# EAGLE schematic usercontroller (EAGLE 8.5.2)
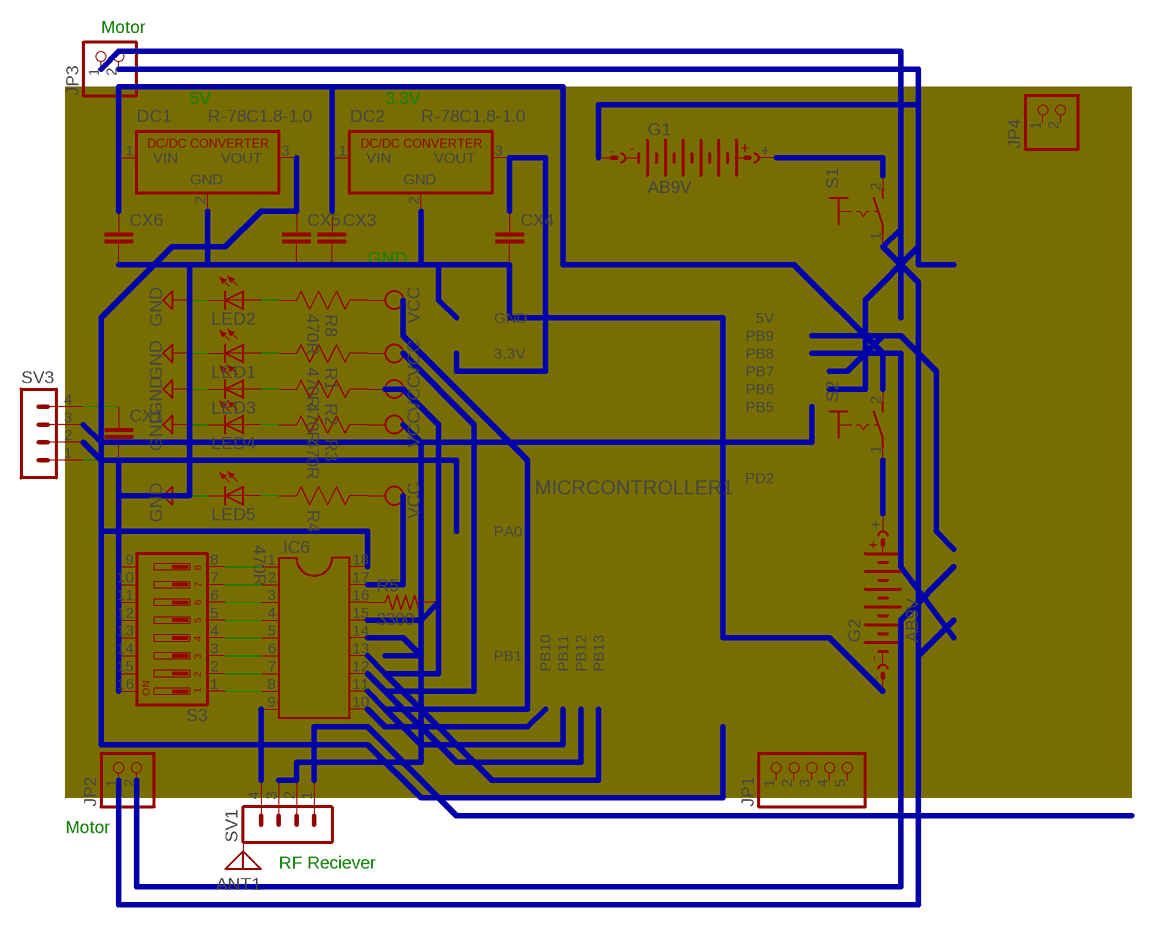
[diagram p0: schematic, sheet 1]

## Parts
ANT1  ANTENNA  [PAD-01]
CX1  CXXC10B5  [XC10B5]
CX3  CXXC10B5  [XC10B5]
CX4  CXXC10B5  [XC10B5]
CX5  CXXC10B5  [XC10B5]
CX6  CXXC10B5  [XC10B5]
DC1  R-78C1.8-1.0  [SIP3]
DC2  R-78C1.8-1.0  [SIP3]
G1  AB9V  [AB9V]
G2  AB9V  [AB9V]
IC6  DIL18  [DIL18]
JP1  PINHD-1X55X2MM  [1_05X2MM]
JP2  PINHD-1X2  [1X02]
JP3  PINHD-1X2  [1X02]
JP4  PINHD-1X2  [1X02]
LED1  LEDCHIP-LED0603  [CHIP-LED0603]
LED2  LEDCHIP-LED0603  [CHIP-LED0603]
LED3  LEDCHIP-LED0603  [CHIP-LED0603]
LED4  LEDCHIP-LED0603  [CHIP-LED0603]
LED5  LEDCHIP-LED0603  [CHIP-LED0603]
R1  470R  MC0.063W06031%330R  [RESC1608X60N]
R2  470R  MC0.063W06031%330R  [RESC1608X60N]
R3  470R  MC0.063W06031%330R  [RESC1608X60N]
R4  470R  MC0.063W06031%330R  [RESC1608X60N]
R5  3300  R-US_0204/2V  [0204V]
R8  470R  MC0.063W06031%330R  [RESC1608X60N]
S1  MS243  [MS243]
S2  MS243  [MS243]
S3  DA08  [DA-08]
SV1  MA04-1  [MA04-1]
SV3  MA04-1  [MA04-1]

## Module instances
MICRCONTROLLER1 = MICRCONTROLLER

## Nets
GND: LED1.C LED2.C LED3.C LED4.C LED5.C
N$1: LED1.A R1.2(R2)
N$2: LED3.A R2.2(R2)
N$3: LED4.A R3.2(R2)
N$4: LED5.A R4.2(R2)
N$6: IC6.8 S3.1
N$7: IC6.7 S3.2
N$8: IC6.6 S3.3
N$9: IC6.5 S3.4
N$10: IC6.4 S3.5
N$11: IC6.3 S3.6
N$12: IC6.2 S3.7
N$13: IC6.1 S3.8
N$14: CX1.1 SV3.4
N$15: CX1.2 SV3.1
N$18: IC6.16 R5.1
N$21: LED2.A R8.2(R2)
VCC: R1.1(R1) R2.1(R1) R3.1(R1) R4.1(R1) R8.1(R1)
Unconnected: ANT1.1 CX3.1 CX3.2 CX4.1 CX4.2 CX5.1 CX5.2 CX6.1 CX6.2 DC1.1(VIN) DC1.2(GND) DC1.3(VOUT) DC2.1(VIN) DC2.2(GND) DC2.3(VOUT) G1.+ G1.- G2.+ G2.- IC6.9 IC6.10 IC6.11 IC6.12 IC6.13 IC6.14 IC6.15 IC6.17 IC6.18 JP1.1 JP1.2 JP1.3 JP1.4 JP1.5 JP2.1 JP2.2 JP3.1 JP3.2 JP4.1 JP4.2 R5.2 S1.1(P) S1.2(S) S2.1(P) S2.2(S) S3.9 S3.10 S3.11 S3.12 S3.13 S3.14 S3.15 S3.16 SV1.1 SV1.2 SV1.3 SV1.4 SV3.2 SV3.3

## Buses
B$1
B$5
B$2
B$3
B$4
B$6
B$7
B$9
B$10
B$8
B$11
B$12
B$13
B$14
B$15
B$16
B$17
B$18
B$19
B$22
B$23
B$26
B$27
B$28
B$30
B$31

## Notes on the sheet
- Motor
- 5V | 3.3V
- GND
- Motor
- RF Reciever

## Library data of the parts
ANT1 = discrete:ANTENNA: Antenna
CX1 CX3-CX6 = rcl:CX: X CAPACITOR for power line; SPICEPREFIX: C
DC1 DC2 = dc-dc-converter:R-78C*-1.0: INNOLINE DC/DC-Converter 1.0 AMP SIP3 Single Output Source: Data sheet <http://www.mikrocontroller.net/attachment/150645/157764-da-01-en-DC_DC_WANDLER_R_78C5_0_1_0.pdf>
G1 G2 = battery:AB9V: 9-V BATTERY CLIP
IC6 = ic-package:DIL18: Dual In Line / Socket
JP1 = pinhead:PINHD-1X5: PIN HEADER
JP2-JP4 = pinhead:PINHD-1X2: PIN HEADER
LED1-LED5 = led:LED: LED OSRAM: - CHIPLED LG R971, LG N971, LY N971, LG Q971, LY Q971, LO R971, LY R971 LH N974, LH R974 LS Q976, LO Q976, LY Q976 LO Q996 - Hyper CHIPLED LW Q18S LB Q993, LB Q99A, LB R99A - SideLED LS A670, LO A670, LY A670, LG A670, LP A670 LB A673, LV A673, LT A673, LW A673 LH A674 LY A675 LS A676, LA A676, LO A676, LY A676, LW A676 LS A679, LY A679, LG A679 - Hyper Micro SIDELED® LS Y876, LA Y876, LO Y876, LY Y876 LT Y87S - SmartLED LW L88C, LW L88S LB L89C, LB L89S, LG L890 LS L89K, LO L89K, LY L89K LS L896, LA L896, LO L896, LY L896 - TOPLED LS T670, LO T670, LY T670, LG T670, LP T670 LSG T670, LSP T670, LSY T670, LOP T670, LYG T670 LG T671, LOG T671, LSG T671 LB T673, LV T673, LT T673, LW T673 LH T674 LS T676, LA T676, LO T676, LY T676, LB T676, LH T676, LSB T676, LW T676 LB T67C, LV T67C, LT T67C, LS T67K, LO T67K, LY T67K, LW E67C LS E67B, LA E67B, LO E67B, LY E67B, LB E67C, LV E67C, LT E67C LW T67C LS T679, LY T679, LG T679 LS T770, LO T770, LY T770, LG T770, LP T770 LB T773, LV T773, LT T773, LW T773 LH T774 LS E675, LA E675, LY E675, LS T675 LS T776, LA T776, LO T776, LY T776, LB T776 LHGB T686 LT T68C, LB T68C - Hyper Mini TOPLED® LB M676 - Mini TOPLED Santana® LG M470 LS M47K, LO M47K, LY M47K Source: http://www.osram.convergy.de LUXEON: - LUMILED® LXK2-PW12-R00, LXK2-PW12-S00, LXK2-PW14-U00, LXK2-PW14-V00 LXK2-PM12-R00, LXK2-PM12-S00, LXK2-PM14-U00 LXK2-PE12-Q00, LXK2-PE12-R00, LXK2-PE12-S00, LXK2-PE14-T00, LXK2-PE14-U00 LXK2-PB12-K00, LXK2-PB12-L00, LXK2-PB12-M00, LXK2-PB14-N00, LXK2-PB14-P00, LXK2-PB14-Q00 LXK2-PR12-L00, LXK2-PR12-M00, LXK2-PR14-Q00, LXK2-PR14-R00 LXK2-PD12-Q00, LXK2-PD12-R00, LXK2-PD12-S00 LXK2-PH12-R00, LXK2-PH12-S00 LXK2-PL12-P00, LXK2-PL12-Q00, LXK2-PL12-R00 Source: www.luxeon.com KINGBRIGHT: KA-3528ASYC Source: www.kingbright.com
R1-R4 R8 = Multicomp:MC0.063W06031%330R: RESISTOR, 0603; MPN: MC0.063W06031%330R; OC_FARNELL: 9331018; OC_NEWARK: -; SUPPLIER: Multicomp; TOLERANCE: ±1%; VALUE: 330 Ohms; WATTAGE: 1/16 W
R5 = rcl:R-US_: RESISTOR, American symbol; SPICEPREFIX: R
S1 S2 = switch:MS243: TOGGLE SWITCH
S3 = switch-dil:DA08: DIL/CODE SWITCH; MPN: MCDA08; OC_FARNELL: 9471561; OC_NEWARK: 26M1092
SV1 SV3 = con-lstb:MA04-1: PIN HEADER; OC_FARNELL: unknown; OC_NEWARK: unknown

## Module MICRCONTROLLER
Ports: PB9(io) PB8(io) PB7(io) PB6(io) PB5(io) PB1(io) PA0(io) PD2(io) 3.3V(io) GND(io) 5V(io) PB10(io) PB11(io) PB12(io) PB13(io)

### Library data of the parts